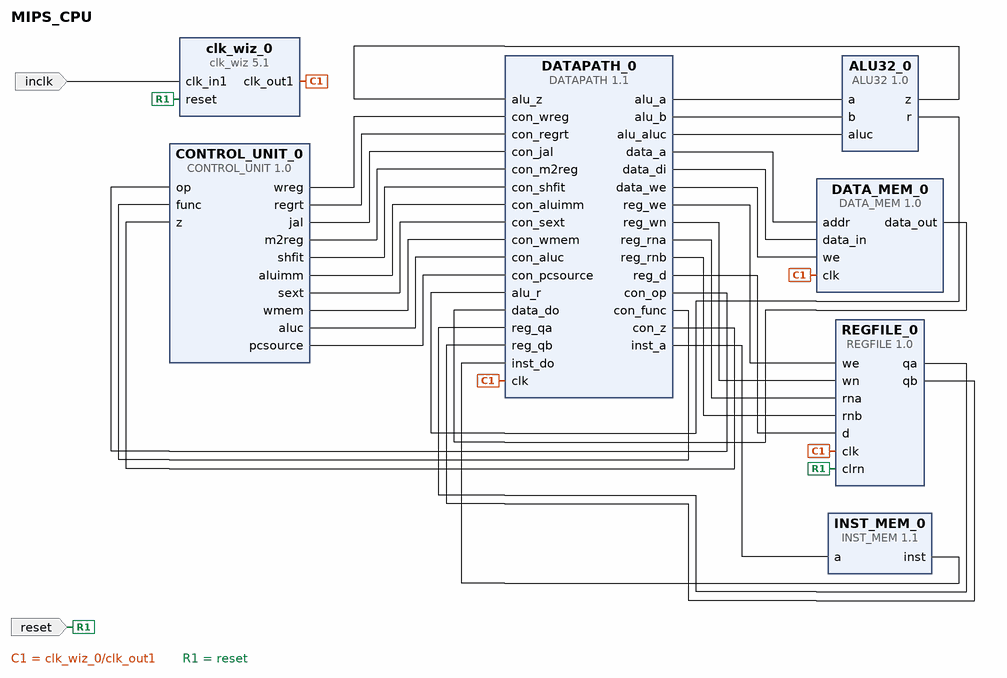
[diagram p0: block diagram of the top level]
# Vivado block design MIPS_CPU, Vivado 2014.2
create_bd_design MIPS_CPU

create_bd_port -dir I reset
create_bd_port -dir I inclk

create_bd_cell -type ip -vlnv dtysky:user:ALU32:1.0 ALU32_0
create_bd_cell -type ip -vlnv dtysky:user:CONTROL_UNIT:1.0 CONTROL_UNIT_0
create_bd_cell -type ip -vlnv dtysky:user:REGFILE:1.0 REGFILE_0
create_bd_cell -type ip -vlnv xilinx.com:ip:clk_wiz:5.1 clk_wiz_0
create_bd_cell -type ip -vlnv dtysky:user:INST_MEM:1.1 INST_MEM_0
create_bd_cell -type ip -vlnv dtysky:user:DATA_MEM:1.0 DATA_MEM_0
create_bd_cell -type ip -vlnv dtysky:user:DATAPATH:1.1 DATAPATH_0

# ---- connections ----

connect_bd_net [get_bd_pins clk_wiz_0/clk_out1] [get_bd_pins REGFILE_0/clk] [get_bd_pins DATA_MEM_0/clk] [get_bd_pins DATAPATH_0/clk]
connect_bd_net [get_bd_ports reset] [get_bd_pins clk_wiz_0/reset] [get_bd_pins REGFILE_0/clrn]
connect_bd_net [get_bd_ports inclk] [get_bd_pins clk_wiz_0/clk_in1]
connect_bd_net [get_bd_pins ALU32_0/z] [get_bd_pins DATAPATH_0/alu_z]
connect_bd_net [get_bd_pins ALU32_0/r] [get_bd_pins DATAPATH_0/alu_r]
connect_bd_net [get_bd_pins REGFILE_0/qa] [get_bd_pins DATAPATH_0/reg_qa]
connect_bd_net [get_bd_pins REGFILE_0/qb] [get_bd_pins DATAPATH_0/reg_qb]
connect_bd_net [get_bd_pins DATAPATH_0/alu_a] [get_bd_pins ALU32_0/a]
connect_bd_net [get_bd_pins DATAPATH_0/alu_b] [get_bd_pins ALU32_0/b]
connect_bd_net [get_bd_pins DATAPATH_0/alu_aluc] [get_bd_pins ALU32_0/aluc]
connect_bd_net [get_bd_pins DATAPATH_0/reg_we] [get_bd_pins REGFILE_0/we]
connect_bd_net [get_bd_pins DATAPATH_0/reg_wn] [get_bd_pins REGFILE_0/wn]
connect_bd_net [get_bd_pins DATAPATH_0/reg_rna] [get_bd_pins REGFILE_0/rna]
connect_bd_net [get_bd_pins DATAPATH_0/reg_rnb] [get_bd_pins REGFILE_0/rnb]
connect_bd_net [get_bd_pins DATAPATH_0/reg_d] [get_bd_pins REGFILE_0/d]
connect_bd_net [get_bd_pins DATAPATH_0/con_op] [get_bd_pins CONTROL_UNIT_0/op]
connect_bd_net [get_bd_pins DATAPATH_0/con_func] [get_bd_pins CONTROL_UNIT_0/func]
connect_bd_net [get_bd_pins DATAPATH_0/con_z] [get_bd_pins CONTROL_UNIT_0/z]
connect_bd_net [get_bd_pins DATAPATH_0/inst_a] [get_bd_pins INST_MEM_0/a]
connect_bd_net [get_bd_pins DATAPATH_0/data_a] [get_bd_pins DATA_MEM_0/addr]
connect_bd_net [get_bd_pins DATAPATH_0/data_di] [get_bd_pins DATA_MEM_0/data_in]
connect_bd_net [get_bd_pins DATAPATH_0/data_we] [get_bd_pins DATA_MEM_0/we]
connect_bd_net [get_bd_pins DATA_MEM_0/data_out] [get_bd_pins DATAPATH_0/data_do]
connect_bd_net [get_bd_pins INST_MEM_0/inst] [get_bd_pins DATAPATH_0/inst_do]
connect_bd_net [get_bd_pins CONTROL_UNIT_0/wreg] [get_bd_pins DATAPATH_0/con_wreg]
connect_bd_net [get_bd_pins CONTROL_UNIT_0/regrt] [get_bd_pins DATAPATH_0/con_regrt]
connect_bd_net [get_bd_pins CONTROL_UNIT_0/jal] [get_bd_pins DATAPATH_0/con_jal]
connect_bd_net [get_bd_pins CONTROL_UNIT_0/m2reg] [get_bd_pins DATAPATH_0/con_m2reg]
connect_bd_net [get_bd_pins CONTROL_UNIT_0/shfit] [get_bd_pins DATAPATH_0/con_shfit]
connect_bd_net [get_bd_pins CONTROL_UNIT_0/aluimm] [get_bd_pins DATAPATH_0/con_aluimm]
connect_bd_net [get_bd_pins CONTROL_UNIT_0/sext] [get_bd_pins DATAPATH_0/con_sext]
connect_bd_net [get_bd_pins CONTROL_UNIT_0/wmem] [get_bd_pins DATAPATH_0/con_wmem]
connect_bd_net [get_bd_pins CONTROL_UNIT_0/aluc] [get_bd_pins DATAPATH_0/con_aluc]
connect_bd_net [get_bd_pins CONTROL_UNIT_0/pcsource] [get_bd_pins DATAPATH_0/con_pcsource]

validate_bd_design
save_bd_design
